# EAGLE schematic sensorNodev1_0 (EAGLE 7.2.0)
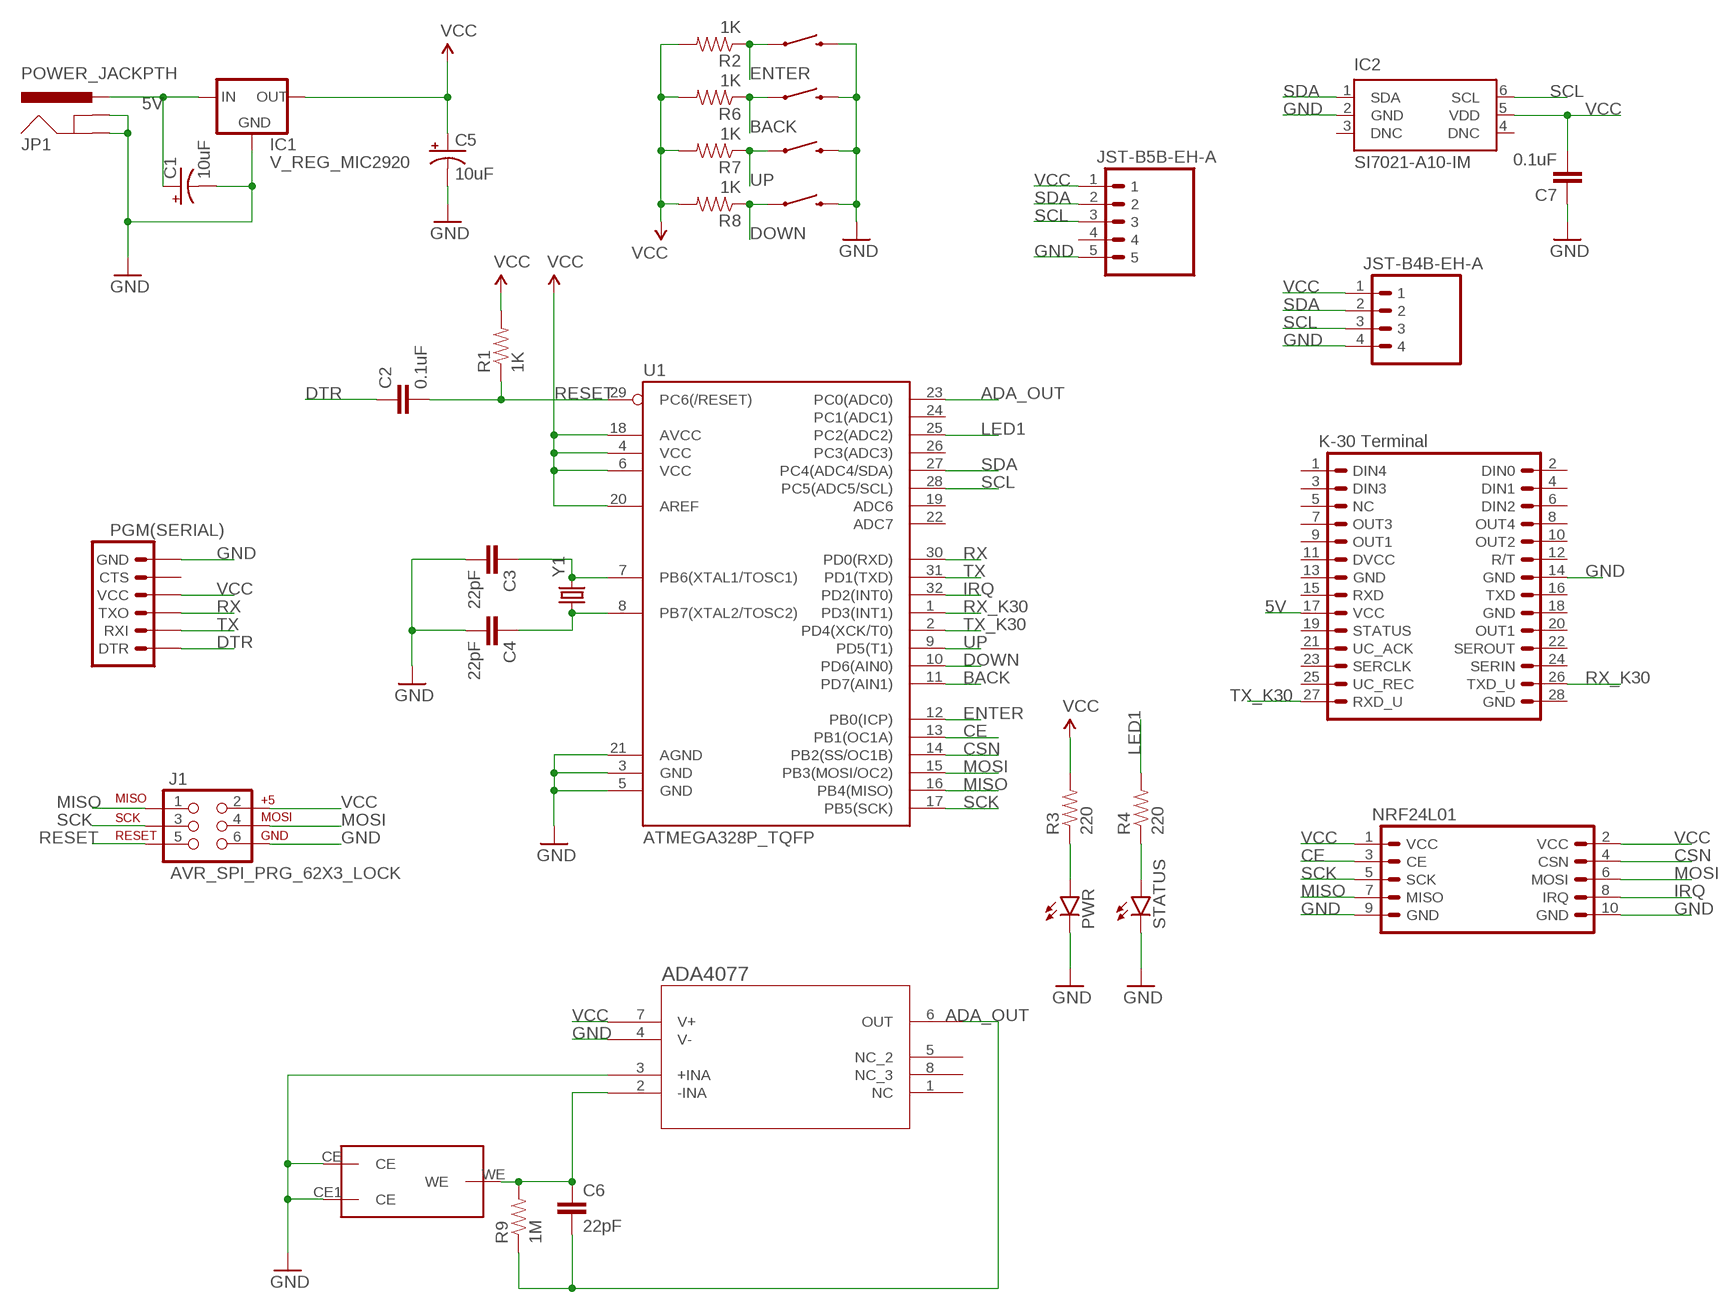
[diagram p0: schematic, sheet 1]

## Parts
BACK  SWITCH-MOMENTARY-2SIDE_EZ  [TACTILE-PTH-SIDEEZ]
C1  10uF  CAP_POLPTH2  [CPOL-RADIAL-10UF-25V]
C2  0.1uF  0.1UF-25V(+80/-20%)(0603)  [0603-CAP]
C3  22pF  22PF-50V-5%(0603)  [0603-CAP]
C4  22pF  22PF-50V-5%(0603)  [0603-CAP]
C5  10uF  CAP_POLPTH2  [CPOL-RADIAL-10UF-25V]
C6  22pF  22PF-50V-5%(0603)  [0603-CAP]
C7  0.1uF  0.1UF-25V(+80/-20%)(0603)  [0603-CAP]
CO2  K-30K-30  [K-30]
DOWN  SWITCH-MOMENTARY-2SIDE_EZ  [TACTILE-PTH-SIDEEZ]
ENTER  SWITCH-MOMENTARY-2SIDE_EZ  [TACTILE-PTH-SIDEEZ]
IC1  V_REG_MIC2920  [SOT223]
IC2  SI7021-A10-IM  [DFN6-3X3]
J1  AVR_SPI_PRG_62X3_LOCK  [2X3_LOCK]
JP1  POWER_JACKPTH  [POWER_JACK_PTH]
LIGHT  JST-B4B-EH-A  [JST-B4B-ED-A]
PGM(SERIAL)  ARDUINO_SERIAL_PROGRAMPTH  [1X06]
PWR  LED0603  [LED-0603]
R1  1K  1KOHM-1/10W-1%(0603)  [0603-RES]
R2  1K  1KOHM-1/10W-1%(0603)  [0603-RES]
R3  220  1KOHM-1/10W-1%(0603)  [0603-RES]
R4  220  1KOHM-1/10W-1%(0603)  [0603-RES]
R6  1K  1KOHM-1/10W-1%(0603)  [0603-RES]
R7  1K  1KOHM-1/10W-1%(0603)  [0603-RES]
R8  1K  1KOHM-1/10W-1%(0603)  [0603-RES]
R9  1M  1KOHM-1/10W-1%(0603)  [0603-RES]
SCREEN  JST-B5B-EH-A  [JST-B5B-ED-A]
STATUS  LED0603  [LED-0603]
U1  ATMEGA328P_TQFP  [TQFP32-08]
U2  ADA4077-1ARZ  [R_8]
U$1  TGS5042A  [TGS5042]
U$2  NRF24L01  [NRF24L01]
UP  SWITCH-MOMENTARY-2SIDE_EZ  [TACTILE-PTH-SIDEEZ]
Y1  CRYSTALHC49US  [HC49US]

## Nets
5V: C1.1(+) CO2.17(VCC) IC1.1(IN) JP1.PWR
ADA_OUT: C6.2 R9.1 U1.23(PC0(ADC0)) U2.6(OUT)
BACK: BACK.1 R6.1 U1.11(PD7(AIN1))
CE: U1.13(PB1(OC1A)) U$2.3(CE)
CSN: U1.14(PB2(SS/OC1B)) U$2.4(CSN)
DOWN: DOWN.1 R8.1 U1.10(PD6(AIN0))
DTR: C2.1 PGM(SERIAL).1(DTR)
ENTER: ENTER.1 R2.1 U1.12(PB0(ICP))
GND: BACK.2 C1.2(-) C3.2 C4.2 C5.2(-) C7.1 CO2.14(GND) DOWN.2 ENTER.2 IC1.2(GND) IC2.2(GND) J1.6 JP1.GND JP1.GNDBREAK LIGHT.4 PGM(SERIAL).6(GND) PWR.C SCREEN.5 STATUS.C U1.3(GND) U1.5(GND) U1.21(AGND) U2.3(+INA) U2.4(V-) U$1.CE U$1.CE1(CE) U$2.9(GND) U$2.10(GND) UP.2
IRQ: U1.32(PD2(INT0)) U$2.8(IRQ)
LED1: R4.2 U1.25(PC2(ADC2))
MISO: J1.1 U1.16(PB4(MISO)) U$2.7(MISO)
MOSI: J1.4 U1.15(PB3(MOSI/OC2)) U$2.6(MOSI)
N$1: C3.1 U1.7(PB6(XTAL1/TOSC1)) Y1.2
N$2: C4.1 U1.8(PB7(XTAL2/TOSC2)) Y1.1
N$4: PWR.A R3.1
N$5: R4.1 STATUS.A
N$12: C6.1 R9.2 U2.2(-INA) U$1.WE
RESET: C2.2 J1.5 R1.1 U1.29(PC6(/RESET))
RX: PGM(SERIAL).3(TXO) U1.30(PD0(RXD))
RX_K30: CO2.26(TXD_U) U1.1(PD3(INT1))
SCK: J1.3 U1.17(PB5(SCK)) U$2.5(SCK)
SCL: IC2.6(SCL) LIGHT.3 SCREEN.3 U1.28(PC5(ADC5/SCL))
SDA: IC2.1(SDA) LIGHT.2 SCREEN.2 U1.27(PC4(ADC4/SDA))
TX: PGM(SERIAL).2(RXI) U1.31(PD1(TXD))
TX_K30: CO2.27(RXD_U) U1.2(PD4(XCK/T0))
UP: R7.1 U1.9(PD5(T1)) UP.1
VCC: C5.1(+) C7.2 IC1.3(OUT) IC2.5(VDD) J1.2 LIGHT.1 PGM(SERIAL).4(VCC) R1.2 R2.2 R3.2 R6.2 R7.2 R8.2 SCREEN.1 U1.4(VCC) U1.6(VCC) U1.18(AVCC) U1.20(AREF) U2.7(V+) U$2.1(VCC) U$2.2(VCC)
Unconnected: CO2.1(DIN4) CO2.2(DIN0) CO2.3(DIN3) CO2.4(DIN1) CO2.5(NC) CO2.6(DIN2) CO2.7(OUT3) CO2.8(OUT4) CO2.9(OUT1) CO2.10(OUT2) CO2.11(DVCC) CO2.12(R/T) CO2.13(GND) CO2.15(RXD) CO2.16(TXD) CO2.18(GND) CO2.19(STATUS) CO2.20(OUT1) CO2.21(UC_ACK) CO2.22(SEROUT) CO2.23(SERCLK) CO2.24(SERIN) CO2.25(UC_REC) CO2.28(GND) IC2.3(DNC) IC2.4(DNC) PGM(SERIAL).5(CTS) SCREEN.4 U1.19(ADC6) U1.22(ADC7) U1.24(PC1(ADC1)) U1.26(PC3(ADC3)) U2.1(NC) U2.5(NC_2) U2.8(NC_3)

## Library data of the parts
BACK DOWN ENTER UP = SparkFun-Electromechanical:SWITCH-MOMENTARY-2: Various NO switches- pushbuttons, reed, etc
C1 C5 = SparkFun-Capacitors:CAP_POL: Capacitor Polarized These are standard SMD and PTH capacitors. Normally 10uF, 47uF, and 100uF in electrolytic and tantalum varieties. Always verify the external diameter of the through hole cap, it varies with capacity, voltage, and manufacturer. The EIA devices should be standard.
C2 C7 = SparkFun-Capacitors:0.1UF-25V(+80/-20%)(0603): CAP-00810 Ceramic Standard decoupling cap; PROD_ID: CAP-00810
C3 C4 C6 = SparkFun-Capacitors:22PF-50V-5%(0603): CAP-07876; PROD_ID: CAP-07876
CO2 = bespin:K-30: 0.1" spaced headers
IC1 = SparkFun-PowerIC:V_REG_MIC2920: MIC2920A (http://www.micrel.com/_PDF/mic2920.pdf) - 400mA output LDO Regulator
IC2 = si70xx-10:SI7021-*: I2C Humidity and Temperature Sensor Source: http://www.silabs.com/Support%20Documents/TechnicalDocs/Si7021.pdf; MF: Silicon Labs; MPN: Si7021-A10-IM; OC_FARNELL: 2422573; OC_NEWARK: 55X3113
J1 = SparkFun-Connectors:AVR_SPI_PRG_6: AVR ISP 6 Pin This is the reduced ISP connector for AVR programming. Common on Arduino. This footprint will take up less PCB space and can be used with a 10-pin to 6-pin adapter such as SKU: BOB-08508 **Special note about "TEST_POINT" package. The stop mask is on the top side, so if you want your programming test points to be on the bottom of your board, make sure to place this package on the bottom side of the board. This also ensure that the orientation to program from the bottom side will be correct.
JP1 = SparkFun-Connectors:POWER_JACK: Power Jack This is the standard 5.5mm barrel jack for power. The PTH is the most common, proven, reliable, footprint. The Slot footprint only works if the mill layer is transmitted to the PCB fab house so be warned. Mating wall wart : TOL-00298 (and others); PROD_ID: CONN-08197
LIGHT = duppy_common:JST-B4B-EH-A
PGM(SERIAL) = SparkFun-Connectors:ARDUINO_SERIAL_PROGRAM: FTDI connector footprints
PWR STATUS = SparkFun-LED:LED: LEDs Standard schematic elements and footprints for 5mm, 3mm, 1206, and 0603 sized LEDs. 5mm - Spark Fun Electronics SKU : COM-00529 (and others)
R1 R2 R6-R8 = SparkFun-Resistors:1KOHM-1/10W-1%(0603): RES-07856; PROD_ID: RES-07856
R3 R4 R9 = SparkFun-Resistors:1KOHM-1/10W-1%(0603): RES-07856; PROD_ID: RES-07856; VALUE: 1K
SCREEN = bespin:JST-B5B-EH-A
U1 = SparkFun-DigitalIC:ATMEGA328P_TQFP; PROD_ID: IC-09069
U2 = bespin:ADA4077-1ARZ
U$1 = bespin:TGS5042
U$2 = bespin:NRF24L01
Y1 = SparkFun-FreqCtrl:CRYSTAL: Various standard crystals. Proven footprints.